# Altium schematic sheet Sheet1.SchDoc
size A4
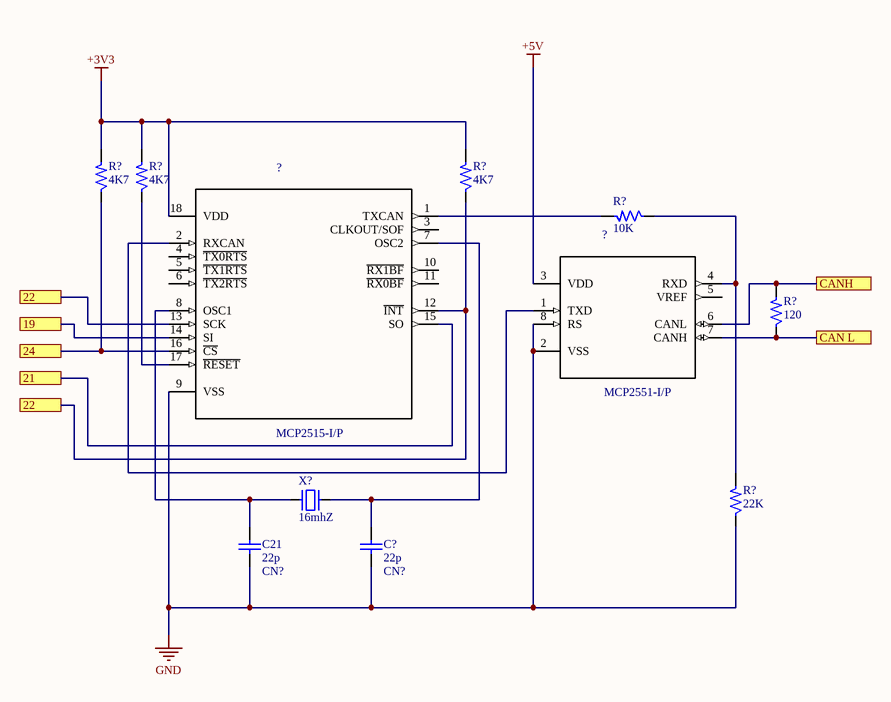
[diagram p0: Sheet1.SchDoc]

## Parts
(Parts that share a designator on the sheet are numbered #1, #2 ... from top to bottom, then left to right.)
?#1  MCP2515-I/P  [*DIP254P762X432-18]
?#2  MCP2551-I/P  [*DIP254P762X432-8]
C21  22p  value CN?  [CNP]
C?  22p  value CN?  [CNP]
R?#1  4K7  [SM-RES-1206]
R?#2  4K7  [SM-RES-1206]
R?#3  4K7  [SM-RES-1206]
R?#4  10K  [SM-RES-1206]
R?#5  120  [SM-RES-1206]
R?#6  22K  [SM-RES-1206]
X?  16mhZ  [XT2]

## Ports
19, 21, 22, 24, CAN L, CANH

## Nets
+3V3: ?#1.18(VDD) R?#1.2 R?#2.2 R?#3.2
+5V: ?#2.3(VDD)
GND: ?#1.9(VSS) ?#2.2(VSS) ?#2.8(RS) C21.1 C?.1 R?#6.1
19: ?#1.14(SI) ; port 19
21: ?#1.15(SO) ; port 21
22: ?#1.12(~{INT}) ?#1.13(SCK) R?#3.1 ; port 22
24: ?#1.16(~{CS}) R?#1.1 ; port 24
CAN L: ?#2.7(CANH) R?#5.1 ; port CAN L
CANH: ?#2.6(CANL) R?#5.2 ; port CANH
Net?#1_1: ?#1.1(TXCAN) R?#4.2
Net?#1_2: ?#1.2(RXCAN) ?#2.1(TXD)
Net?#1_7: ?#1.7(OSC2) C?.2 X?.2
Net?#1_8: ?#1.8(OSC1) C21.2 X?.1
Net?#1_17: ?#1.17(~{RESET}) R?#2.1
Net?#2_4: ?#2.4(RXD) R?#4.1 R?#6.2

Not connected (* = marked no-connect by the designer): ?#1 3(CLKOUT/SOF) 4(~{TX0RTS}) 5(~{TX1RTS}) 6(~{TX2RTS}) 10(~{RX1BF}) 11(~{RX0BF}); ?#2 5(VREF)

## Library data of the parts
?#1 = MCP2515-I/P: MCP2515 Series 5.5 V 1 Mb/s Stand Alone SPI Interface CAN Controller - PDIP-18; MF: Microchip; MP: MCP2515-I/P; SnapEDA_Link: https://www.snapeda.com/parts/MCP2515-I/P/Microchip/view-part/?ref=snap; Price: None; Package: DIP-18 Microchip; Availability: Unavailable; Value: *
?#2 = MCP2551-I/P: MCP2551 Series 5.5 V 1 Mb/s Surface Mount High-Speed CAN Transceiver - PDIP-8; MF: Microchip; MP: MCP2551-I/P; SnapEDA_Link: https://www.snapeda.com/parts/MCP2551-I/P/Microchip/view-part/?ref=snap; Price: None; Package: DIP-8 Microchip; Availability: Unavailable; Value: *
C21 C? = Cap Semi: Capacitor (Semiconductor SIM Model); Value: 104; LatestRevisionDate: 17-Jul-2002; LatestRevisionNote: Re-released for DXP Platform.; PackageReference: C1206; Publisher: Altium Limited
R?#1-R?#6 = R: Resistor 1/4W; Value: R1/4W - 1K
X? = XT2: Crystal For all Crystal 2pin.; Value: 4Mhz